# EAGLE schematic TRC_main1.0.0 (EAGLE 9.6.2)
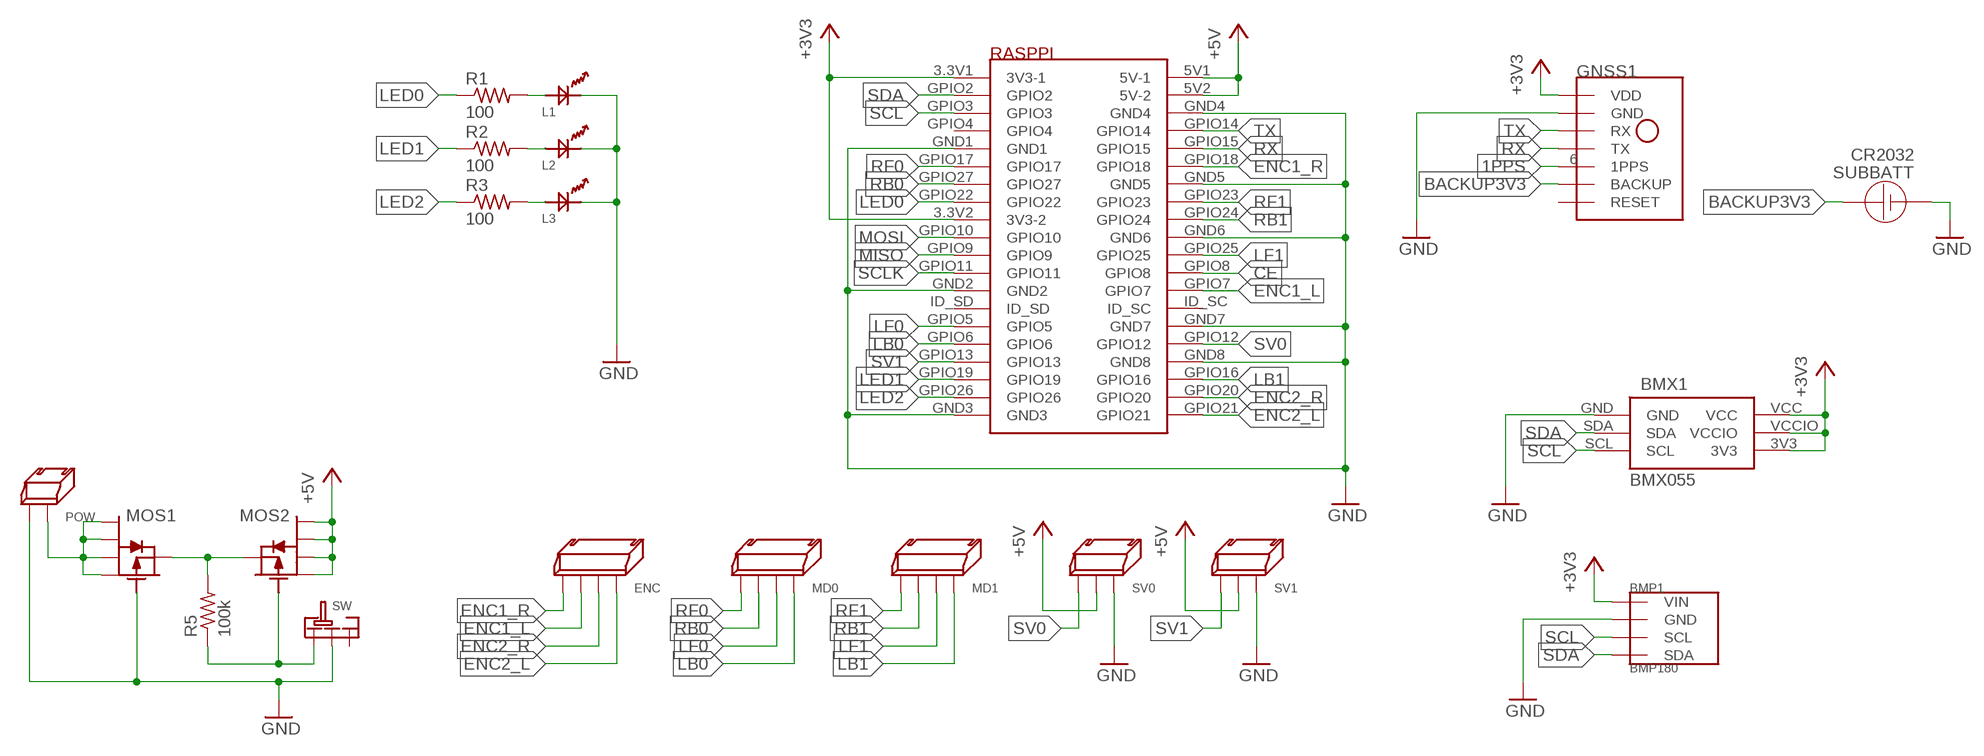
[diagram p0: schematic, sheet 1]

## Parts
BMP1  BMP180  [GY-68]
BMX1  BMX055  [BMX055]
ENC  4PIN_SIDE  [4PIN_SIDE]
GNSS1  GYSFDMAXB  [GYSFDMAXB]
L1  OSXX1608C1A  [OSXX1608C1A]
L2  OSXX1608C1A  [OSXX1608C1A]
L3  OSXX1608C1A  [OSXX1608C1A]
MD0  4PIN_SIDE  [4PIN_SIDE]
MD1  4PIN_SIDE  [4PIN_SIDE]
MOS1  PCH_SSM6J808R  [SSM6J808R]
MOS2  PCH_SSM6J808R  [SSM6J808R]
POW  2PIN_SIDE  [2PIN_SIDE]
R1  100  R-US_R0603  [R0603]
R2  100  R-US_R0603  [R0603]
R3  100  R-US_R0603  [R0603]
R5  100k  R-US_R0603  [R0603]
RASPPI  RASPBERYPIZEROW  [RASPBERYPIZEROW]
SUBBATT  CR2032  [CR2032]
SV0  3PIN_SIDE  [3PIN_SIDE]
SV1  3PIN_SIDE  [3PIN_SIDE]
SW  SRIDE_SWITCH  [SRIDE_SWITCH]

## Nets
1PPS: GNSS1.6(1PPS)
+3V3: BMP1.P1(VIN) BMX1.3V3 BMX1.VCC BMX1.VCCIO GNSS1.16(VDD) RASPPI.3.3V1(3V3-1) RASPPI.3.3V2(3V3-2)
+5V: MOS2.1 MOS2.2 MOS2.5 MOS2.6 RASPPI.5V1(5V-1) RASPPI.5V2(5V-2) SV0.P$1 SV1.P$1
BACKUP3V3: GNSS1.14(BACKUP) SUBBATT.VCC SUBBATT.VCC2(VCC)
CE: RASPPI.GPIO8
ENC1_L: ENC.P$1 RASPPI.GPIO7
ENC1_R: ENC.P$2 RASPPI.GPIO18
ENC2_L: ENC.P$4 RASPPI.GPIO21
ENC2_R: ENC.P$3 RASPPI.GPIO20
GND: BMP1.P2(GND) BMX1.GND GNSS1.1(GND) GNSS1.2(GND) GNSS1.7(GND) GNSS1.10(GND) GNSS1.12(GND) GNSS1.19(GND) GNSS1.20(GND) L1.CT L2.CT L3.CT MOS1.3 POW.P$2 RASPPI.GND1 RASPPI.GND2 RASPPI.GND3 RASPPI.GND4 RASPPI.GND5 RASPPI.GND6 RASPPI.GND7 RASPPI.GND8 SUBBATT.GND SV0.P$3 SV1.P$3 SW.LR
LB0: MD0.P$4 RASPPI.GPIO6
LB1: MD1.P$4 RASPPI.GPIO16
LED0: R1.1 RASPPI.GPIO22
LED1: R2.1 RASPPI.GPIO19
LED2: R3.1 RASPPI.GPIO26
LF0: MD0.P$3 RASPPI.GPIO5
LF1: MD1.P$3 RASPPI.GPIO25
MISO: RASPPI.GPIO9
MOSI: RASPPI.GPIO10
N$1: L1.AN R1.2
N$2: L2.AN R2.2
N$3: L3.AN R3.2
N$6: MOS1.4 MOS2.4 R5.2
N$7: MOS2.3 R5.1 SW.L
N$8: MOS1.1 MOS1.2 MOS1.5 MOS1.6 POW.P$1
RB0: MD0.P$1 RASPPI.GPIO27
RB1: MD1.P$1 RASPPI.GPIO24
RF0: MD0.P$2 RASPPI.GPIO17
RF1: MD1.P$2 RASPPI.GPIO23
RX: GNSS1.5(TX) RASPPI.GPIO15
SCL: BMP1.P3(SCL) BMX1.SCL RASPPI.GPIO3
SCLK: RASPPI.GPIO11
SDA: BMP1.P4(SDA) BMX1.SDA RASPPI.GPIO2
SV0: RASPPI.GPIO12 SV0.P$2
SV1: RASPPI.GPIO13 SV1.P$2
TX: GNSS1.3(RX) RASPPI.GPIO14
Unconnected: GNSS1.4(RESET) RASPPI.GPIO4 RASPPI.ID_SC RASPPI.ID_SD SW.R

## Library data of the parts
BMP1 = BMP180:BMP180
BMX1 = BMX055:BMX055
ENC MD0 MD1 = XR Connector:4PIN_SIDE
GNSS1 = GYSFDMAXB:GYSFDMAXB
L1-L3 = Chip LED:OSXX1608C1A
MOS1 MOS2 = Chip MOSFET:PCH_SSM6J808R
POW = XR Connector:2PIN_SIDE
R1-R3 R5 = rcl:R-US_: RESISTOR, American symbol; SPICEPREFIX: R
RASPPI = RaspberyPiZeroW:RASPBERYPIZEROW
SUBBATT = CR2032:CR2032
SV0 SV1 = XR Connector:3PIN_SIDE
SW = Sride Switch:SRIDE_SWITCH